# Altium project RobonAUT_Project.PrjPcb
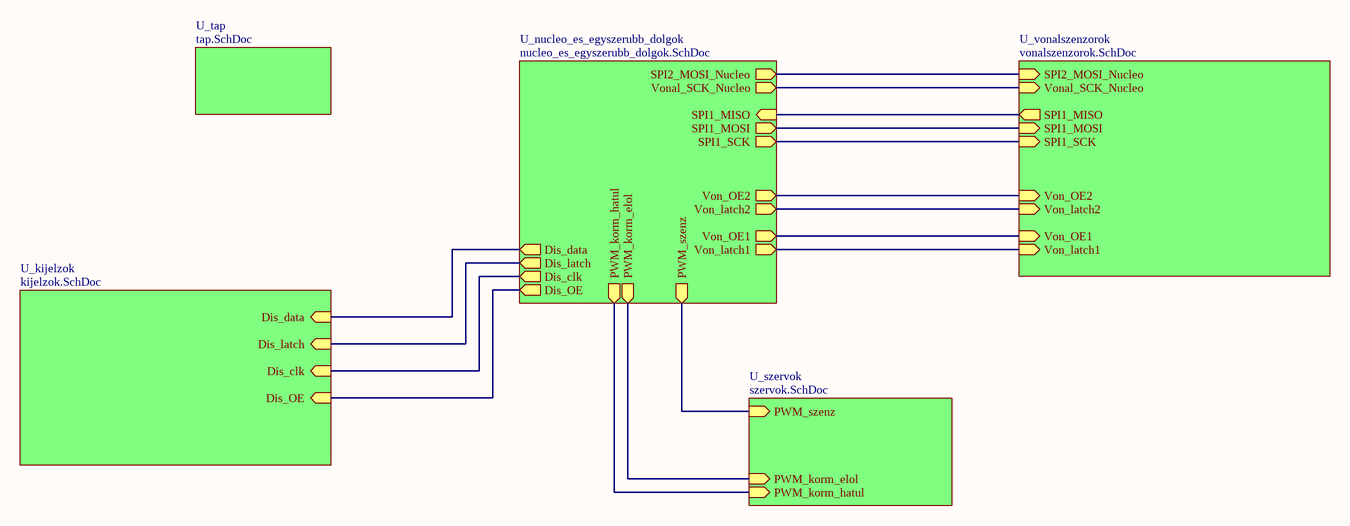
[diagram p0: main.SchDoc]
6 sheets, 70 parts. Net scope: global (net labels, ports and power ports of the same name join across sheets).
Board file: RobonAUT_PCB.PcbDoc
Sheets:
  main.SchDoc
    U_kijelzok = kijelzok.SchDoc
    U_nucleo_es_egyszerubb_dolgok = nucleo_es_egyszerubb_dolgok.SchDoc
    U_tap = tap.SchDoc
    U_vonalszenzorok = vonalszenzorok.SchDoc
    U_szervok = szervok.SchDoc

## Sheet main.SchDoc
size A4

### Sub-sheets
U_kijelzok = kijelzok.SchDoc: Dis_OE (in), Dis_clk (in), Dis_data (in), Dis_latch (in)
U_nucleo_es_egyszerubb_dolgok = nucleo_es_egyszerubb_dolgok.SchDoc: SPI2_MOSI_Nucleo (out), Vonal_SCK_Nucleo (out), PWM_korm_hatul (out), PWM_korm_elol (out), SPI1_MOSI (out), SPI1_MISO (in), SPI1_SCK (out), Dis_latch (out), Dis_data (out), Dis_OE (out), Dis_clk (out), Von_latch2 (out), Von_OE2 (out), Von_OE1 (out), Von_latch1 (out), PWM_szenz (out)
U_szervok = szervok.SchDoc: PWM_szenz (in), PWM_korm_elol (in), PWM_korm_hatul (in)
U_tap = tap.SchDoc: no entries
U_vonalszenzorok = vonalszenzorok.SchDoc: SPI2_MOSI_Nucleo (in), Vonal_SCK_Nucleo (in), SPI1_MISO (out), SPI1_MOSI (in), SPI1_SCK (in), Von_OE1 (in), Von_latch2 (in), Von_OE2 (in), Von_latch1 (in)

### Nets
(unnamed): sheet U_kijelzok/Dis_OE, sheet U_nucleo_es_egyszerubb_dolgok/Dis_OE
(unnamed): sheet U_kijelzok/Dis_clk, sheet U_nucleo_es_egyszerubb_dolgok/Dis_clk
(unnamed): sheet U_kijelzok/Dis_data, sheet U_nucleo_es_egyszerubb_dolgok/Dis_data
(unnamed): sheet U_kijelzok/Dis_latch, sheet U_nucleo_es_egyszerubb_dolgok/Dis_latch
(unnamed): sheet U_nucleo_es_egyszerubb_dolgok/SPI2_MOSI_Nucleo, sheet U_vonalszenzorok/SPI2_MOSI_Nucleo
(unnamed): sheet U_nucleo_es_egyszerubb_dolgok/Vonal_SCK_Nucleo, sheet U_vonalszenzorok/Vonal_SCK_Nucleo
(unnamed): sheet U_nucleo_es_egyszerubb_dolgok/PWM_korm_hatul, sheet U_szervok/PWM_korm_hatul
(unnamed): sheet U_nucleo_es_egyszerubb_dolgok/PWM_korm_elol, sheet U_szervok/PWM_korm_elol
(unnamed): sheet U_nucleo_es_egyszerubb_dolgok/SPI1_MOSI, sheet U_vonalszenzorok/SPI1_MOSI
(unnamed): sheet U_nucleo_es_egyszerubb_dolgok/SPI1_MISO, sheet U_vonalszenzorok/SPI1_MISO
(unnamed): sheet U_nucleo_es_egyszerubb_dolgok/SPI1_SCK, sheet U_vonalszenzorok/SPI1_SCK
(unnamed): sheet U_nucleo_es_egyszerubb_dolgok/Von_latch2, sheet U_vonalszenzorok/Von_latch2
(unnamed): sheet U_nucleo_es_egyszerubb_dolgok/Von_OE2, sheet U_vonalszenzorok/Von_OE2
(unnamed): sheet U_nucleo_es_egyszerubb_dolgok/Von_OE1, sheet U_vonalszenzorok/Von_OE1
(unnamed): sheet U_nucleo_es_egyszerubb_dolgok/Von_latch1, sheet U_vonalszenzorok/Von_latch1
(unnamed): sheet U_nucleo_es_egyszerubb_dolgok/PWM_szenz, sheet U_szervok/PWM_szenz

## Sheet kijelzok.SchDoc
size A4
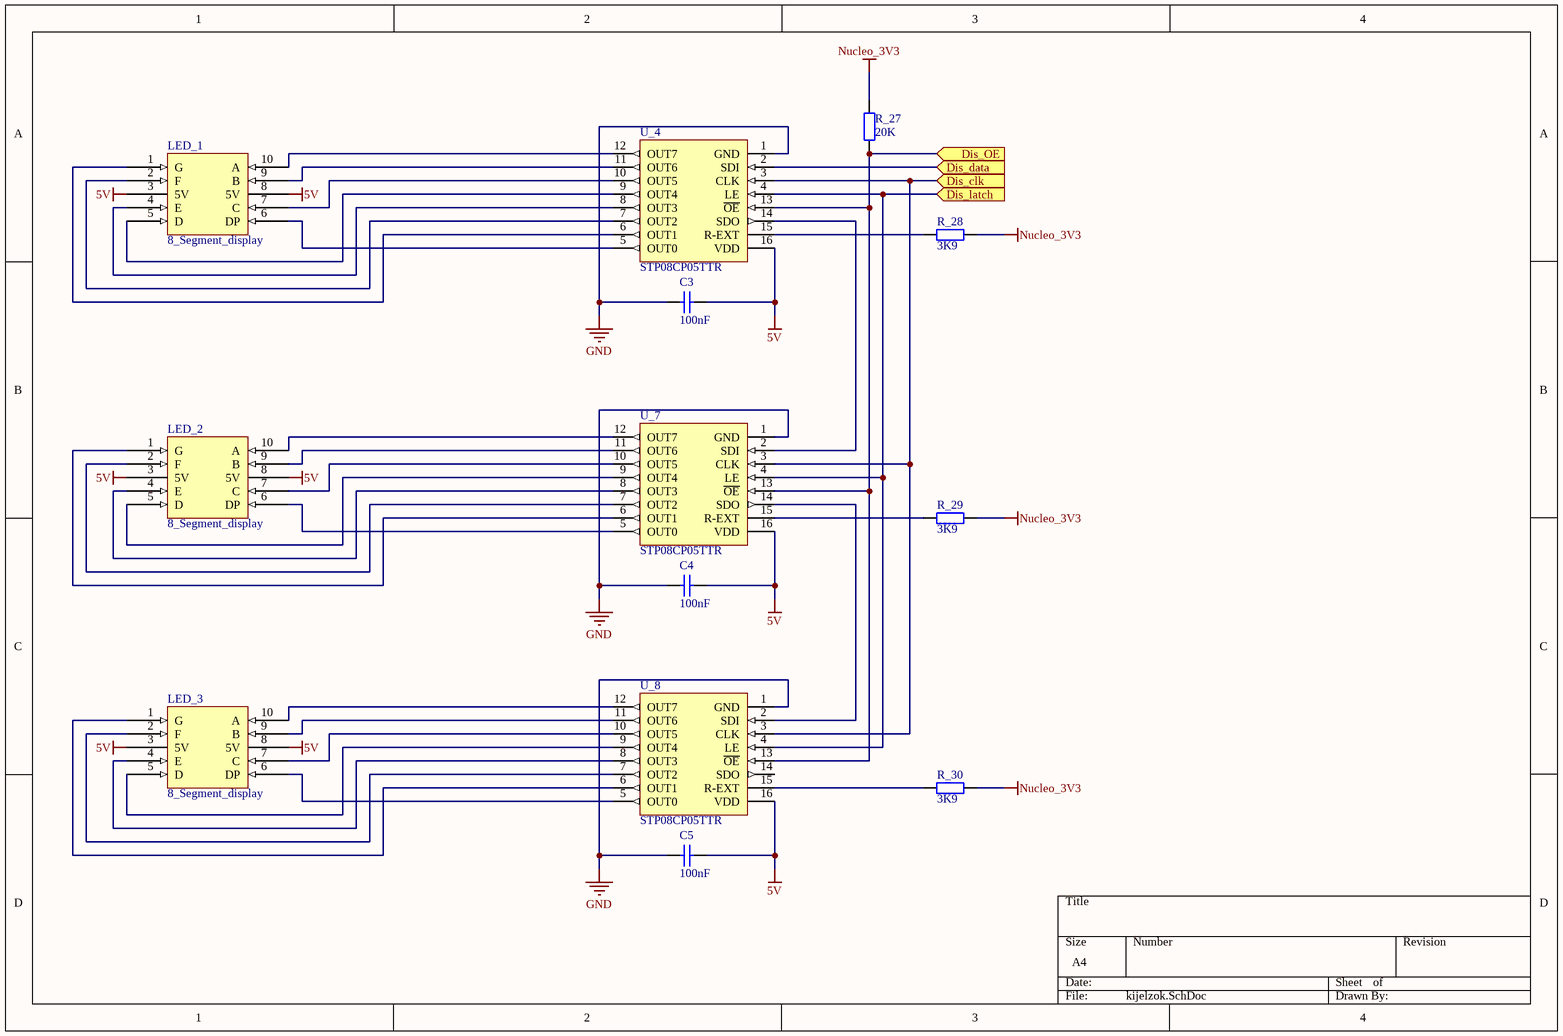
[diagram p1: kijelzok.SchDoc]

### Parts
C3  100nF  [FP_0402_CAP_050]
C4  100nF  [FP_0402_CAP_050]
C5  100nF  [FP_0402_CAP_050]
LED_1  8_Segment_display  [8 Segment Display]
LED_2  8_Segment_display  [8 Segment Display]
LED_3  8_Segment_display  [8 Segment Display]
R_27  20K  [FP_0603_RES]
R_28  3K9  [FP_0603_RES]
R_29  3K9  [FP_0603_RES]
R_30  3K9  [FP_0603_RES]
U_4  STP08CP05TTR  [SOP127P600-sajat_0095-015]
U_7  STP08CP05TTR  [SOP127P600-sajat_0095-015]
U_8  STP08CP05TTR  [SOP127P600-sajat_0095-015]

### Ports
Dis_clk (in), Dis_data (in), Dis_latch (in), Dis_OE (in)

### Nets
5V: C3.2 C4.2 C5.2 LED_1.3(5V) LED_1.8(5V) LED_2.3(5V) LED_2.8(5V) LED_3.3(5V) LED_3.8(5V) U_4.16(VDD) U_7.16(VDD) U_8.16(VDD)
GND: C3.1 C4.1 C5.1 U_4.1(GND) U_7.1(GND) U_8.1(GND)
Nucleo_3V3: R_27.2 R_28.2 R_29.2 R_30.2
NetLED_1_1: LED_1.1(G) U_4.6(OUT1)
NetLED_1_2: LED_1.2(F) U_4.7(OUT2)
NetLED_1_4: LED_1.4(E) U_4.8(OUT3)
NetLED_1_5: LED_1.5(D) U_4.9(OUT4)
NetLED_1_6: LED_1.6(DP) U_4.5(OUT0)
NetLED_1_7: LED_1.7(C) U_4.10(OUT5)
NetLED_1_9: LED_1.9(B) U_4.11(OUT6)
NetLED_1_10: LED_1.10(A) U_4.12(OUT7)
NetLED_2_1: LED_2.1(G) U_7.6(OUT1)
NetLED_2_2: LED_2.2(F) U_7.7(OUT2)
NetLED_2_4: LED_2.4(E) U_7.8(OUT3)
NetLED_2_5: LED_2.5(D) U_7.9(OUT4)
NetLED_2_6: LED_2.6(DP) U_7.5(OUT0)
NetLED_2_7: LED_2.7(C) U_7.10(OUT5)
NetLED_2_9: LED_2.9(B) U_7.11(OUT6)
NetLED_2_10: LED_2.10(A) U_7.12(OUT7)
NetLED_3_1: LED_3.1(G) U_8.6(OUT1)
NetLED_3_2: LED_3.2(F) U_8.7(OUT2)
NetLED_3_4: LED_3.4(E) U_8.8(OUT3)
NetLED_3_5: LED_3.5(D) U_8.9(OUT4)
NetLED_3_6: LED_3.6(DP) U_8.5(OUT0)
NetLED_3_7: LED_3.7(C) U_8.10(OUT5)
NetLED_3_9: LED_3.9(B) U_8.11(OUT6)
NetLED_3_10: LED_3.10(A) U_8.12(OUT7)
NetR_27_1: R_27.1 U_4.13(~{OE}) U_7.13(~{OE}) U_8.13(~{OE}) ; port Dis_OE
NetR_28_1: R_28.1 U_4.15(R-EXT)
NetR_29_1: R_29.1 U_7.15(R-EXT)
NetR_30_1: R_30.1 U_8.15(R-EXT)
NetU3_30: U_4.2(SDI) ; port Dis_data
NetU3_35: U_4.4(LE) U_7.4(LE) U_8.4(LE) ; port Dis_latch
NetU3_37: U_4.3(CLK) U_7.3(CLK) U_8.3(CLK) ; port Dis_clk
NetU_4_14: U_4.14(SDO) U_7.2(SDI)
NetU_7_14: U_7.14(SDO) U_8.2(SDI)

Not connected (* = marked no-connect by the designer): U_8 14(SDO)

### Library data of the parts
C3-C5 = CAP: Capacitor; Value: 100nF
R_27-R_30 = RES: Resistor
  R_27: Value: 20K
  R_28-R_30: Value: 3K9
U_4 U_7 U_8 = STP08CP05TTR: Low voltage, low current power 8-bit shift register
LED_1-LED_3 = 8_Segment_display: Supplier: lomex; Reference: 35-03-94

## Sheet nucleo_es_egyszerubb_dolgok.SchDoc
size A4
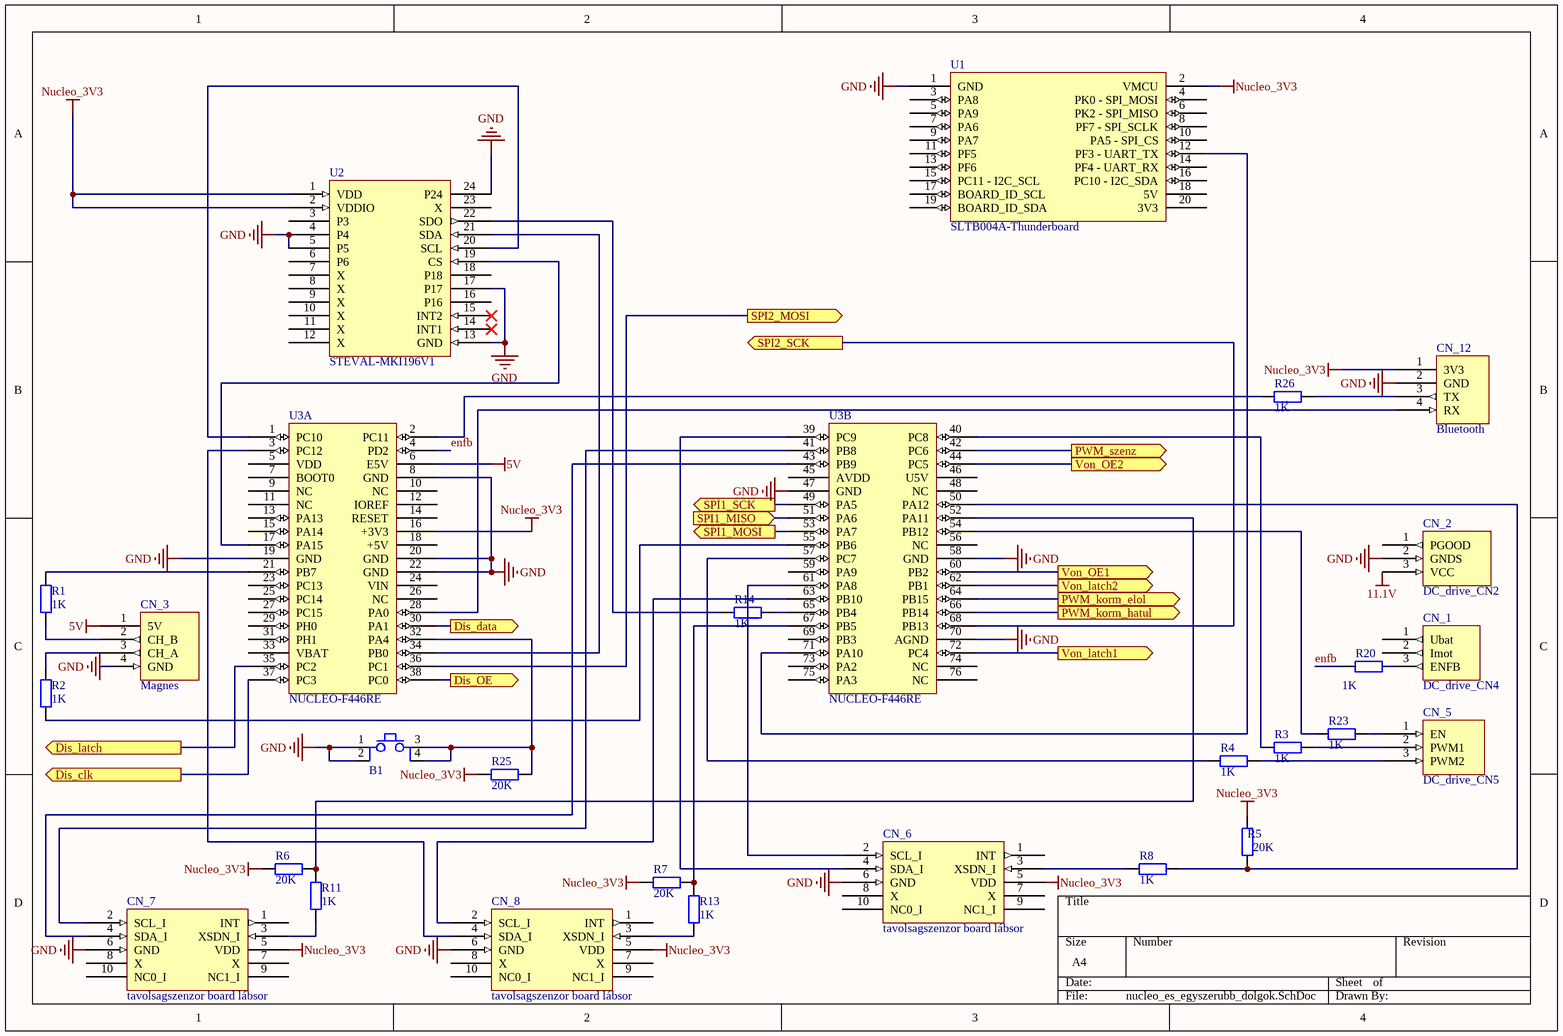
[diagram p2: nucleo_es_egyszerubb_dolgok.SchDoc]

### Parts
B1  Button  [FP_BTN_SMD]  (value not drawn)
CN_1  DC_drive_CN4  [DC_Drive_CN_Stelvio]
CN_2  DC_drive_CN2  [DC_Drive_CN_Stelvio]
CN_3  Magnes  [FP_CONN4_TAP_254MM]
CN_5  DC_drive_CN5  [DC_Drive_CN_Stelvio]
CN_6  tavolsagszenzor board lábsor  [6P konnektor (távolságszenzor)]
CN_7  tavolsagszenzor board lábsor  [6P konnektor (távolságszenzor)]
CN_8  tavolsagszenzor board lábsor  [6P konnektor (távolságszenzor)]
CN_12  Bluetooth  [FP_CONN4_TAP_254MM_90]
R1  1K  [FP_0603_RES]
R2  1K  [FP_0603_RES]
R3  1K  [FP_0603_RES]
R4  1K  [FP_0603_RES]
R5  20K  [FP_0603_RES]
R6  20K  [FP_0603_RES]
R7  20K  [FP_0603_RES]
R8  1K  [FP_0603_RES]
R11  1K  [FP_0603_RES]
R13  1K  [FP_0603_RES]
R14  1K  [FP_0603_RES]
R20  1K  [FP_0603_RES]
R23  1K  [FP_0603_RES]
R25  20K  [FP_0603_RES]
R26  1K  [FP_0603_RES]
U1  SLTB004A-Thunderboard  [SLTB004A]
U2  STEVAL-MKI196V1  [STEVAL IMU 20 tüske anya]
U3  NUCLEO-F446RE  [FP_NUCLEO-64]  (parts A,B of 2)

### Ports
Dis_clk (out), Dis_data (out), Dis_latch (out), Dis_OE (out), PWM_korm_elol (out), PWM_korm_hatul (out), PWM_szenz (out), SPI1_MISO (in), SPI1_MOSI (out), SPI1_SCK (out), SPI2_MOSI (out), SPI2_SCK (out), Von_latch1 (out), Von_latch2 (out), Von_OE1 (out), Von_OE2 (out)

### Nets
5V: CN_3.1(5V) U3.6(E5V)
11.1V: CN_2.3(VCC)
GND: B1.1 B1.2 CN_2.2(GNDS) CN_3.4(GND) CN_6.6(GND) CN_7.6(GND) CN_8.6(GND) CN_12.2(GND) U1.1(GND) U2.4(P4) U2.5(P5) U2.13(GND) U2.17(P17) U2.24(P24) U3.8(GND) U3.19(GND) U3.20(GND) U3.22(GND) U3.47(GND) U3.58(GND) U3.70(AGND)
Nucleo_3V3: CN_6.5(VDD) CN_7.5(VDD) CN_8.5(VDD) CN_12.1(3V3) R5.2 R6.1 R7.1 R25.1 U1.2(VMCU) U2.1(VDD) U2.2(VDDIO) U3.16(+3V3)
enfb: R20.1 U3.4(PD2)
NetB1_3: B1.3 B1.4 R25.2 U3.32(PA4)
NetCN_1_3: CN_1.3(ENFB) R20.2
NetCN_3_2: CN_3.2(CH_B) R1.1
NetCN_3_3: CN_3.3(CH_A) R2.2
NetCN_5_1: CN_5.1(EN) R23.2
NetCN_5_2: CN_5.2(PWM1) R3.2
NetCN_5_3: CN_5.3(PWM2) R4.2
NetCN_6_2: CN_6.2(SCL_I) U3.61(PA8)
NetCN_6_3: CN_6.3(XSDN_I) R8.1
NetCN_6_4: CN_6.4(SDA_I) U3.39(PC9)
NetCN_7_2: CN_7.2(SCL_I) U3.41(PB8)
NetCN_7_3: CN_7.3(XSDN_I) R11.1
NetCN_7_4: CN_7.4(SDA_I) U3.43(PB9)
NetCN_8_2: CN_8.2(SCL_I) U3.63(PB10)
NetCN_8_3: CN_8.3(XSDN_I) R13.1
NetCN_8_4: CN_8.4(SDA_I) U3.3(PC12)
NetCN_12_3: CN_12.3(TX) R26.2
NetCN_12_4: CN_12.4(RX) U3.28(PA0)
NetR1_2: R1.2 U3.21(PB7)
NetR2_1: R2.1 U3.55(PB6)
NetR3_1: R3.1 U3.40(PC8)
NetR4_1: R4.1 U3.57(PC7)
NetR5_1: R5.1 R8.2 U3.50(PA12)
NetR6_2: R6.2 R11.2 U3.52(PA11)
NetR7_2: R7.2 R13.2 U3.67(PB5)
NetR9_1: U3.53(PA7) ; port SPI1_MOSI
NetR10_2: U3.49(PA5) ; port SPI1_SCK
NetR12_1: U3.51(PA6) ; port SPI1_MISO
NetR14_1: R14.1 U2.22(SDO)
NetR14_2: R14.2 U3.65(PB4)
NetR15_1: U3.60(PB2) ; port Von_OE1
NetR16_1: U3.68(PB13) ; port SPI2_SCK
NetR23_1: R23.1 U3.54(PB12)
NetR24_1: U3.44(PC5) ; port Von_OE2
NetR26_1: R26.1 U3.2(PC11)
NetR31_1: U3.64(PB15) ; port PWM_korm_elol
NetR32_1: U3.66(PB14) ; port PWM_korm_hatul
NetR33_1: U3.42(PC6) ; port PWM_szenz
NetR_27_1: U3.38(PC0) ; port Dis_OE
NetU1_12: U1.12(PF3_-_UART_TX) U3.71(PA10)
NetU2_19: U2.19(CS) U3.17(PA15)
NetU2_20: U2.20(SCL) U3.1(PC10)
NetU2_21: U2.21(SDA) U3.34(PB0)
NetU3_30: U3.30(PA1) ; port Dis_data
NetU3_35: U3.35(PC2) ; port Dis_latch
NetU3_36: U3.36(PC1) ; port SPI2_MOSI
NetU3_37: U3.37(PC3) ; port Dis_clk
NetU3_62: U3.62(PB1) ; port Von_latch2
NetU3_72: U3.72(PC4) ; port Von_latch1

Not connected (* = marked no-connect by the designer): CN_1 1(Ubat) 2(Imot); CN_2 1(PGOOD); CN_6 1(INT) 7(X) 8(X) 9(NC1_I) 10(NC0_I); CN_7 1(INT) 7(X) 8(X) 9(NC1_I) 10(NC0_I); CN_8 1(INT) 7(X) 8(X) 9(NC1_I) 10(NC0_I); U1 3(PA8) 4(PK0_-_SPI_MOSI) 5(PA9) 6(PK2_-_SPI_MISO) 7(PA6) 8(PF7_-_SPI_SCLK) 9(PA7) 10(PA5_-_SPI_CS) 11(PF5) 13(PF6) 14(PF4_-_UART_RX) 15(PC11_-_I2C_SCL) 16(PC10_-_I2C_SDA) 17(BOARD_ID_SCL) 18(5V) 19(BOARD_ID_SDA) 20(3V3); U2 3(P3) 6(P6) 7(X) 8(X) 9(X) 10(X) 11(X) 12(X) 14(INT1)* 15(INT2)* 16(P16) 18(P18) 23(X); U3 5(VDD) 7(BOOT0) 9(NC) 10(NC) 11(NC) 12(IOREF) 13(PA13) 14(RESET) 15(PA14) 18(+5V) 23(PC13) 24(VIN) 25(PC14) 26(NC) 27(PC15) 29(PH0) 31(PH1) 33(VBAT) 45(AVDD) 46(U5V) 48(NC) 56(NC) 59(PA9) 69(PB3) 73(PA2) 74(NC) 75(PA3) 76(NC)

### Library data of the parts
B1 = Button 4P: Push button
CN_1 = DC_drive_CN4: CN4 a motvez kártyán a neve
CN_2 = DC_drive_CN2: CN2 a motvez kártyán a neve; supplier: AUT
CN_3 = Encoder: A1333; Supplier: AUT
CN_5 = DC_drive_CN5: CN5 a motvez kártyán a neve; supplier: AUT
CN_6-CN_8 = VL53L1X-satel: megvan: igen; supplier: ST
CN_12 = HC-05: HC-05 tokozva, kérdés, hogy melyik lábon vannak valójában a dolgok; reference2: 100.355.62 (gomb nélkül); reference1: 100.416.39 (gombbal); reference3: 100.355.65 (master-slave); supplier: hestore
R1-R8 R11 R13 R14 R20 R23 R25 R26 = RES: Resistor
  R1-R4 R8 R11 R13 R14 R20 R23 R26: Value: 1K
  R5-R7 R25: Value: 20K
U1 = SLTB004A: SiLabs Thunderboard Sense 2 module
U2 = STEVAL-MKI176V1: LSM6DS3H, SPI
U3 = NUCLEO-F446RE: Reference: NUCLEO; Name: Nucleo F446RE; Supplier: Tanszék

## Sheet tap.SchDoc
size A4
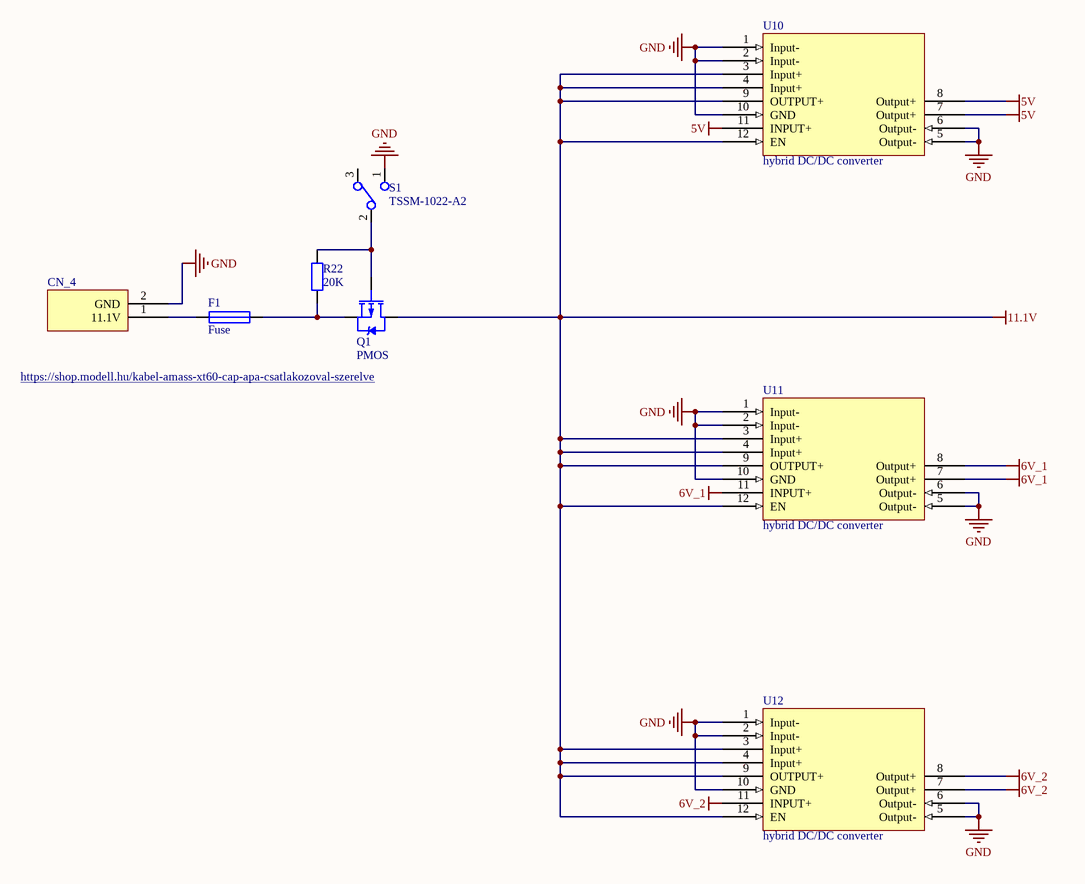
[diagram p3: tap.SchDoc]

### Parts
CN_4  https://shop.modell.hu/kabel-amass-xt60-cap-apa-csatlakozoval-szerelve  [Táp akksihoz]
F1  Fuse  [FP_CONN2_TUSKE_254MM]
Q1  PMOS  [FP_DPAK-TO252]
R22  20K  [FP_0603_RES]
S1  TSSM-1022-A2  [SajatSwitch]
U10  hybrid DC/DC converter  [DC-DC konverter közös]
U11  hybrid DC/DC converter  [DC-DC konverter közös]
U12  hybrid DC/DC converter  [DC-DC konverter közös]

### Nets
5V: U10.7(Output+) U10.8(Output+) U10.11(INPUT+)
6V_1: U11.7(Output+) U11.8(Output+) U11.11(INPUT+)
6V_2: U12.7(Output+) U12.8(Output+) U12.11(INPUT+)
11.1V: Q1.2(D) U10.3(Input+) U10.4(Input+) U10.9(OUTPUT+) U10.12(EN) U11.3(Input+) U11.4(Input+) U11.9(OUTPUT+) U11.12(EN) U12.3(Input+) U12.4(Input+) U12.9(OUTPUT+) U12.12(EN)
GND: CN_4.2(GND) S1.1(C1) U10.1(Input-) U10.2(Input-) U10.5(Output-) U10.6(Output-) U10.10(GND) U11.1(Input-) U11.2(Input-) U11.5(Output-) U11.6(Output-) U11.10(GND) U12.1(Input-) U12.2(Input-) U12.5(Output-) U12.6(Output-) U12.10(GND)
NetCN_4_1: CN_4.1(11.1V) F1.1
NetF1_2: F1.2 Q1.3(S) R22.1
NetQ1_1: Q1.1(G) R22.2 S1.2(C2)

Not connected (* = marked no-connect by the designer): S1 3(C3)

### Library data of the parts
CN_4 = akksi 11.1V: akksi 11.1V, csatlakozó: XT60; supplier: shop.model.hu; reference: https://shop.modell.hu/kabel-amass-xt60-cap-apa-csatlakozoval-szerelve
Q1 = PMOS: MOSFET, P CH
R22 = RES: Resistor; Value: 20K
S1 = SajatSwitch: Reference: 100.264.66; Supplier: Hestore
U10 = DSN-1504-3A_5 / STDN-3A24-ADJ_5: hybrid dc/dc: DSN-1504-3A / STDN-3A24-ADJ; 5V
U11 U12 = DSN-1504-3A_6 / STDN-3A24-ADJ_6: hybrid dc/dc: DSN-1504-3A / STDN-3A24-ADJ; 6V

## Sheet vonalszenzorok.SchDoc
size A4
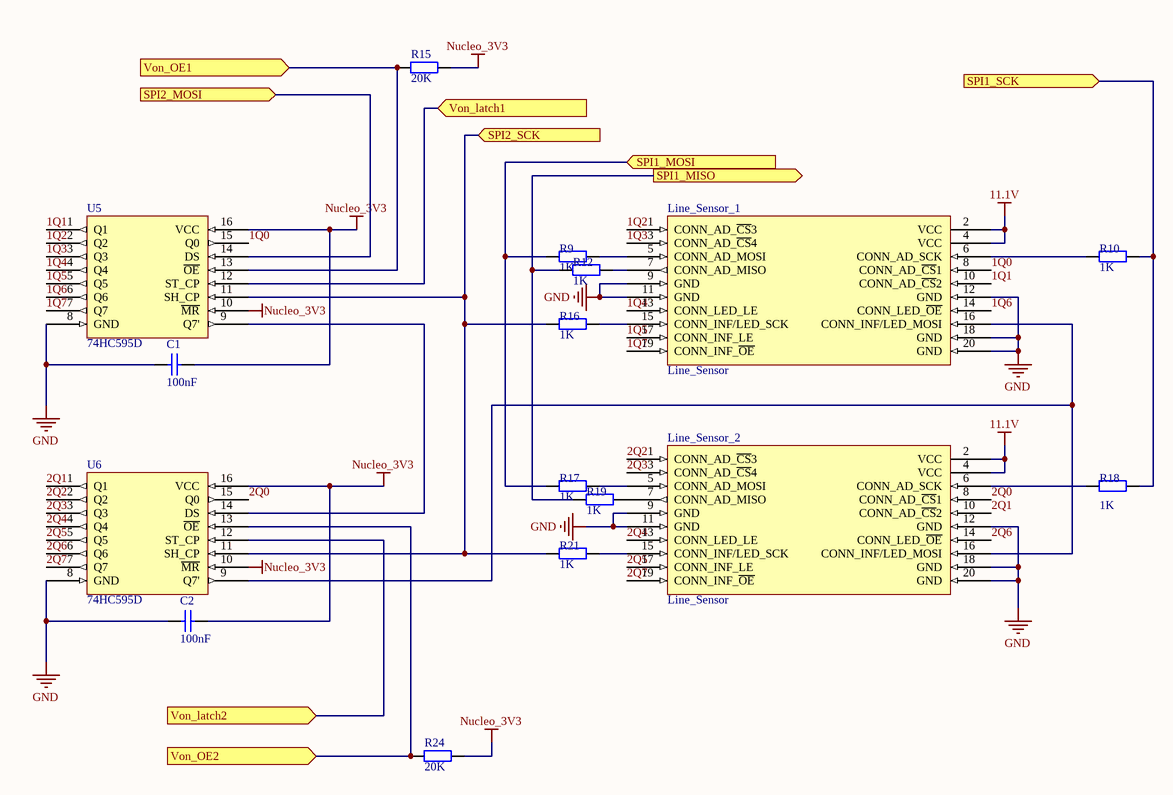
[diagram p4: vonalszenzorok.SchDoc]

### Parts
C1  100nF  [FP_0402_CAP_050]
C2  100nF  [FP_0402_CAP_050]
Line_Sensor_1  Line_Sensor  [CONNECTOR-20P]
Line_Sensor_2  Line_Sensor  [CONNECTOR-20P]
R9  1K  [FP_0603_RES]
R10  1K  [FP_0603_RES]
R12  1K  [FP_0603_RES]
R15  20K  [FP_0603_RES]
R16  1K  [FP_0603_RES]
R17  1K  [FP_0603_RES]
R18  1K  [FP_0603_RES]
R19  1K  [FP_0603_RES]
R21  1K  [FP_0603_RES]
R24  20K  [FP_0603_RES]
U5  74HC595D  [SO16 (Pl.:Shift-registerhez)]
U6  74HC595D  [SO16 (Pl.:Shift-registerhez)]

### Ports
SPI1_MISO (out), SPI1_MOSI (in), SPI1_SCK (in), SPI2_MOSI (in), SPI2_SCK (in), Von_latch1 (in), Von_latch2 (in), Von_OE1 (in), Von_OE2 (in)

### Nets
11.1V: Line_Sensor_1.2(VCC) Line_Sensor_1.4(VCC) Line_Sensor_2.2(VCC) Line_Sensor_2.4(VCC)
GND: C1.1 C2.1 Line_Sensor_1.9(GND) Line_Sensor_1.11(GND) Line_Sensor_1.12(GND) Line_Sensor_1.18(GND) Line_Sensor_1.20(GND) Line_Sensor_2.9(GND) Line_Sensor_2.11(GND) Line_Sensor_2.12(GND) Line_Sensor_2.18(GND) Line_Sensor_2.20(GND) U5.8(GND) U6.8(GND)
Nucleo_3V3: C1.2 C2.2 R15.2 R24.2 U5.10(~{MR}) U5.16(VCC) U6.10(~{MR}) U6.16(VCC)
1Q0: Line_Sensor_1.8(CONN_AD_~{CS}1) U5.15(Q0)
1Q1: Line_Sensor_1.10(CONN_AD_~{CS}2) U5.1(Q1)
1Q2: Line_Sensor_1.1(CONN_AD_~{CS}3) U5.2(Q2)
1Q3: Line_Sensor_1.3(CONN_AD_~{CS}4) U5.3(Q3)
1Q4: Line_Sensor_1.13(CONN_LED_LE) U5.4(Q4)
1Q5: Line_Sensor_1.17(CONN_INF_LE) U5.5(Q5)
1Q6: Line_Sensor_1.14(CONN_LED_~{OE}) U5.6(Q6)
1Q7: Line_Sensor_1.19(CONN_INF_~{OE}) U5.7(Q7)
2Q0: Line_Sensor_2.8(CONN_AD_~{CS}1) U6.15(Q0)
2Q1: Line_Sensor_2.10(CONN_AD_~{CS}2) U6.1(Q1)
2Q2: Line_Sensor_2.1(CONN_AD_~{CS}3) U6.2(Q2)
2Q3: Line_Sensor_2.3(CONN_AD_~{CS}4) U6.3(Q3)
2Q4: Line_Sensor_2.13(CONN_LED_LE) U6.4(Q4)
2Q5: Line_Sensor_2.17(CONN_INF_LE) U6.5(Q5)
2Q6: Line_Sensor_2.14(CONN_LED_~{OE}) U6.6(Q6)
2Q7: Line_Sensor_2.19(CONN_INF_~{OE}) U6.7(Q7)
NetLine_Sensor_1_5: Line_Sensor_1.5(CONN_AD_MOSI) R9.2
NetLine_Sensor_1_6: Line_Sensor_1.6(CONN_AD_SCK) R10.1
NetLine_Sensor_1_7: Line_Sensor_1.7(CONN_AD_MISO) R12.2
NetLine_Sensor_1_15: Line_Sensor_1.15(CONN_INF/LED_SCK) R16.2
NetLine_Sensor_1_16: Line_Sensor_1.16(CONN_INF/LED_MOSI) Line_Sensor_2.16(CONN_INF/LED_MOSI) U6.9(Q7')
NetLine_Sensor_2_5: Line_Sensor_2.5(CONN_AD_MOSI) R17.2
NetLine_Sensor_2_6: Line_Sensor_2.6(CONN_AD_SCK) R18.1
NetLine_Sensor_2_7: Line_Sensor_2.7(CONN_AD_MISO) R19.2
NetLine_Sensor_2_15: Line_Sensor_2.15(CONN_INF/LED_SCK) R21.2
NetR9_1: R9.1 R17.1 ; port SPI1_MOSI
NetR10_2: R10.2 R18.2 ; port SPI1_SCK
NetR12_1: R12.1 R19.1 ; port SPI1_MISO
NetR15_1: R15.1 U5.13(~{OE}) ; port Von_OE1
NetR16_1: R16.1 R21.1 U5.11(SH_CP) U6.11(SH_CP) ; port SPI2_SCK
NetR24_1: R24.1 U6.13(~{OE}) ; port Von_OE2
NetU3_36: U5.14(DS) ; port SPI2_MOSI
NetU3_62: U6.12(ST_CP) ; port Von_latch2
NetU3_72: U5.12(ST_CP) ; port Von_latch1
NetU5_9: U5.9(Q7') U6.14(DS)

### Library data of the parts
C1 C2 = CAP: Capacitor; Value: 100nF
Line_Sensor_1 Line_Sensor_2 = Line_Sensor: AUT
R9 R10 R12 R15-R19 R21 R24 = RES: Resistor
  R9 R10 R12 R16-R19 R21: Value: 1K
  R15 R24: Value: 20K
U5 U6 = 74HC595D: Vonalszenzorhoz; Supplier: Lomex; Reference: 87-01-20

## Sheet szervok.SchDoc
size A4
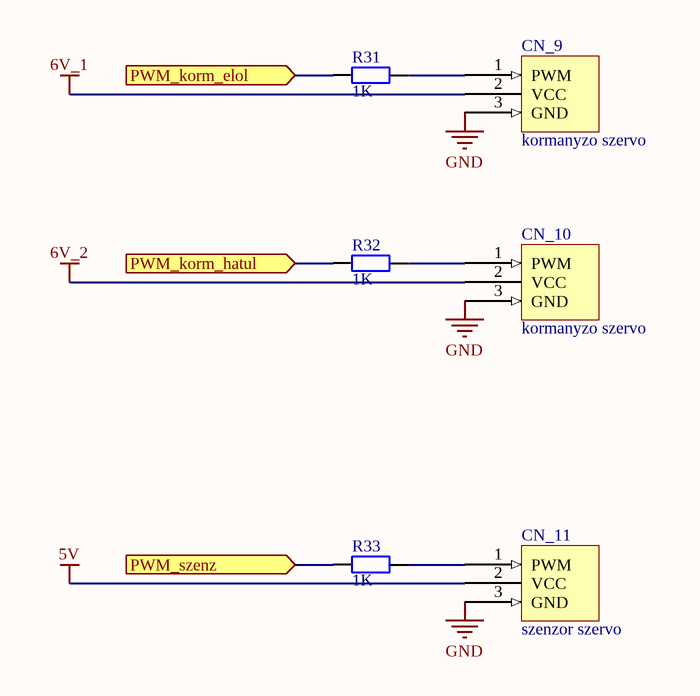
[diagram p5: szervok.SchDoc]

### Parts
CN_9  kormanyzo szervo  [FP_CONN3_TUSKE_254MM]
CN_10  kormanyzo szervo  [FP_CONN3_TUSKE_254MM]
CN_11  szenzor szervo  [FP_CONN3_TUSKE_254MM]
R31  1K  [FP_0603_RES]
R32  1K  [FP_0603_RES]
R33  1K  [FP_0603_RES]

### Ports
PWM_korm_elol (in), PWM_korm_hatul (in), PWM_szenz (in)

### Nets
5V: CN_11.2(VCC)
6V_1: CN_9.2(VCC)
6V_2: CN_10.2(VCC)
GND: CN_9.3(GND) CN_10.3(GND) CN_11.3(GND)
NetCN_9_1: CN_9.1(PWM) R31.2
NetCN_10_1: CN_10.1(PWM) R32.2
NetCN_11_1: CN_11.1(PWM) R33.2
NetR31_1: R31.1 ; port PWM_korm_elol
NetR32_1: R32.1 ; port PWM_korm_hatul
NetR33_1: R33.1 ; port PWM_szenz

### Library data of the parts
CN_9 CN_10 = MG-995 servo: reference: 100.358.11; supplier: hestore
CN_11 = HPI MS-22 servo: szenzor szervo (gyari)
R31-R33 = RES: Resistor; Value: 1K

## Nets that join several sheets
5V: kijelzok (12 pins), nucleo_es_egyszerubb_dolgok (CN_3.1 U3.6), tap (U10.7 U10.8 U10.11), szervok (CN_11.2)
6V_1: tap (U11.7 U11.8 U11.11), szervok (CN_9.2)
6V_2: tap (U12.7 U12.8 U12.11), szervok (CN_10.2)
11.1V: nucleo_es_egyszerubb_dolgok (CN_2.3), tap (13 pins), vonalszenzorok (Line_Sensor_1.2 Line_Sensor_1.4 Line_Sensor_2.2 Line_Sensor_2.4)
GND: kijelzok (6 pins), nucleo_es_egyszerubb_dolgok (21 pins), tap (17 pins), vonalszenzorok (14 pins), szervok (CN_9.3 CN_10.3 CN_11.3)
Nucleo_3V3: kijelzok (R_27.2 R_28.2 R_29.2 R_30.2), nucleo_es_egyszerubb_dolgok (12 pins), vonalszenzorok (8 pins)
NetR9_1: nucleo_es_egyszerubb_dolgok (U3.53), vonalszenzorok (R9.1 R17.1)
NetR10_2: nucleo_es_egyszerubb_dolgok (U3.49), vonalszenzorok (R10.2 R18.2)
NetR12_1: nucleo_es_egyszerubb_dolgok (U3.51), vonalszenzorok (R12.1 R19.1)
NetR15_1: nucleo_es_egyszerubb_dolgok (U3.60), vonalszenzorok (R15.1 U5.13)
NetR16_1: nucleo_es_egyszerubb_dolgok (U3.68), vonalszenzorok (R16.1 R21.1 U5.11 U6.11)
NetR24_1: nucleo_es_egyszerubb_dolgok (U3.44), vonalszenzorok (R24.1 U6.13)
NetR31_1: nucleo_es_egyszerubb_dolgok (U3.64), szervok (R31.1)
NetR32_1: nucleo_es_egyszerubb_dolgok (U3.66), szervok (R32.1)
NetR33_1: nucleo_es_egyszerubb_dolgok (U3.42), szervok (R33.1)
NetR_27_1: kijelzok (R_27.1 U_4.13 U_7.13 U_8.13), nucleo_es_egyszerubb_dolgok (U3.38)
NetU3_30: kijelzok (U_4.2), nucleo_es_egyszerubb_dolgok (U3.30)
NetU3_35: kijelzok (U_4.4 U_7.4 U_8.4), nucleo_es_egyszerubb_dolgok (U3.35)
NetU3_36: nucleo_es_egyszerubb_dolgok (U3.36), vonalszenzorok (U5.14)
NetU3_37: kijelzok (U_4.3 U_7.3 U_8.3), nucleo_es_egyszerubb_dolgok (U3.37)
NetU3_62: nucleo_es_egyszerubb_dolgok (U3.62), vonalszenzorok (U6.12)
NetU3_72: nucleo_es_egyszerubb_dolgok (U3.72), vonalszenzorok (U5.12)